# Altium schematic sheet MCU-STM32F767.SchDoc
size A4
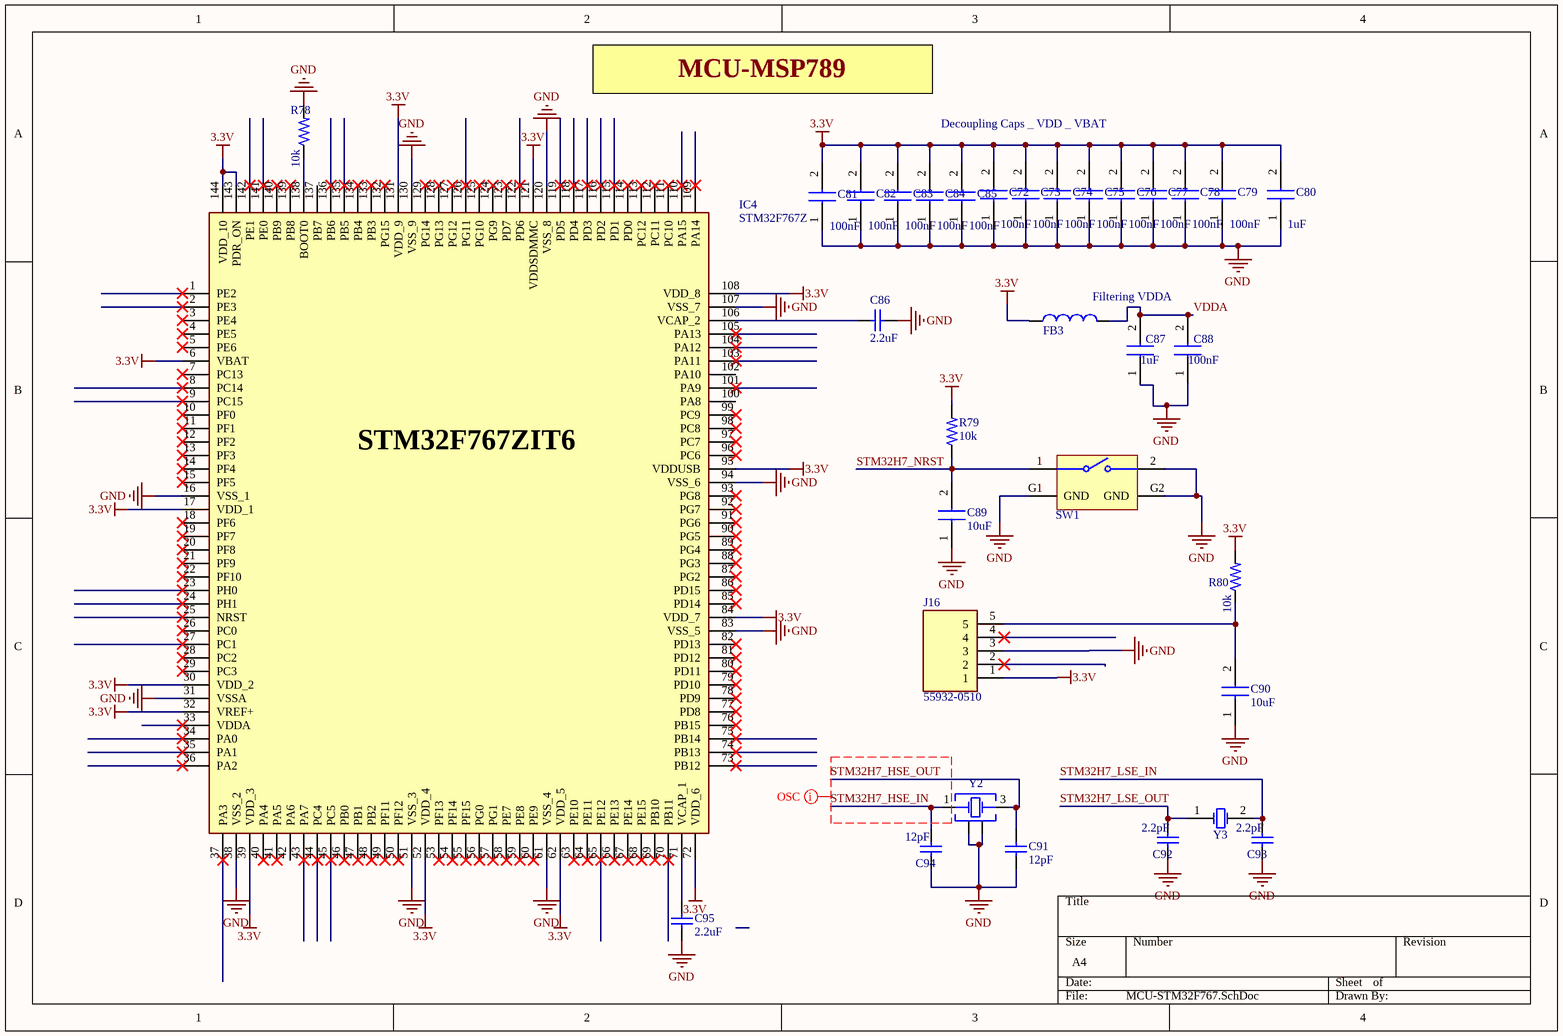
[diagram p0: MCU-STM32F767.SchDoc]

## Parts
C72  100nF  [CAPC1005X55N]
C73  100nF  [CAPC1005X55N]
C74  100nF  [CAPC1005X55N]
C75  100nF  [CAPC1005X55N]
C76  100nF  [CAPC1005X55N]
C77  100nF  [CAPC1005X55N]
C78  100nF  [CAPC1005X55N]
C79  100nF  [CAPC1005X55N]
C80  1uF  [CAPC1005X55N]
C81  100nF  [CAPC1005X55N]
C82  100nF  [CAPC1005X55N]
C83  100nF  [CAPC1005X55N]
C84  100nF  [CAPC1005X55N]
C85  100nF  [CAPC1005X55N]
C86  2.2uF  [WCAP-CSST_0603_L1.6W0.8H0.8_Reflow]
C87  1uF  [CAPC1005X55N]
C88  100nF  [CAPC1005X55N]
C89  10uF  [CAPC1005X55N]
C90  10uF  [CAPC1005X55N]
C91  12pF  [WCAP-CSST_0603_L1.6W0.8H0.8_Reflow]
C92  2.2pF  [WCAP-CSST_0603_L1.6W0.8H0.8_Reflow]
C93  2.2pF  [WCAP-CSST_0603_L1.6W0.8H0.8_Reflow]
C94  12pF  [WCAP-CSST_0603_L1.6W0.8H0.8_Reflow]
C95  2.2uF  [WCAP-CSST_0603_L1.6W0.8H0.8_Reflow]
FB3  10Ohm  [WE-CBA_0603_L1.6W0.8H0.8_HF/HS/WB]  (value not drawn)
IC4  STM32F767Z  [QFP50P2200X2200X160-144N]
J16  55932-0510  [559320510]
R78  10k  [RESC2012X65N]
R79  10k  [RESC2012X65N]
R80  10k  [RESC2012X65N]
SW1  431256058716  [4312560587x6]  (value not drawn)
Y2  25MHz  [WE-XTAL_CFPX-180]  (value not drawn)
Y3  32.768kHz  [WE-XTAL_IQXC-25]  (value not drawn)

## Nets
3.3V: C72.2 C73.2 C74.2 C75.2 C76.2 C77.2 C78.2 C79.2 C80.2 C81.2 C82.2 C83.2 C84.2 C85.2 FB3.1 IC4.6(VBAT) IC4.17(VDD_1) IC4.30(VDD_2) IC4.32(VREF+) IC4.39(VDD_3) IC4.52(VDD_4) IC4.62(VDD_5) IC4.72(VDD_6) IC4.84(VDD_7) IC4.95(VDDUSB) IC4.108(VDD_8) IC4.121(VDDSDMMC) IC4.131(VDD_9) IC4.143(PDR_ON) IC4.144(VDD_10) J16.1 R79.2 R80.2
GND: C72.1 C73.1 C74.1 C75.1 C76.1 C77.1 C78.1 C79.1 C80.1 C81.1 C82.1 C83.1 C84.1 C85.1 C86.2 C87.1 C88.1 C89.1 C90.1 C91.2 C92.2 C93.2 C94.2 C95.1 IC4.16(VSS_1) IC4.31(VSSA) IC4.38(VSS_2) IC4.51(VSS_3) IC4.61(VSS_4) IC4.83(VSS_5) IC4.94(VSS_6) IC4.107(VSS_7) IC4.120(VSS_8) IC4.130(VSS_9) J16.3 R78.2 SW1.2 SW1.G1(GND) SW1.G2(GND) Y2.2(GND&Lid) Y2.4(GND&Lid)
STM32H7_HSE_IN: C94.1 Y2.1(Crystal)
STM32H7_HSE_OUT: C91.1 Y2.3(Crystal)
STM32H7_LSE_IN: C93.1 Y3.2(OSC2)
STM32H7_LSE_OUT: C92.1 Y3.1(OSC1)
STM32H7_NRST: C89.2 R79.1 SW1.1
VDDA: C87.2 C88.2 FB3.2
NetC86_1: C86.1 IC4.106(VCAP_2)
NetC90_2: C90.2 J16.5 R80.1
NetC95_2: C95.2 IC4.71(VCAP_1)
NetIC4_138: IC4.138(BOOT0) R78.1

Not connected (* = marked no-connect by the designer): IC4 1(PE2)* 2(PE3)* 3(PE4)* 4(PE5)* 5(PE6)* 7(PC13)* 8(PC14)* 9(PC15)* 10(PF0)* 11(PF1)* 12(PF2)* 13(PF3)* 14(PF4)* 15(PF5)* 18(PF6)* 19(PF7)* 20(PF8)* 21(PF9)* 22(PF10)* 23(PH0)* 24(PH1)* 25(NRST)* 26(PC0)* 27(PC1)* 28(PC2)* 29(PC3)* 33(VDDA)* 34(PA0)* 35(PA1)* 36(PA2)* 37(PA3)* 40(PA4)* 41(PA5)* 42(PA6) 43(PA7)* 44(PC4)* 45(PC5)* 46(PB0)* 47(PB1)* 48(PB2)* 49(PF11)* 50(PF12)* 53(PF13)* 54(PF14)* 55(PF15)* 56(PG0)* 57(PG1)* 58(PE7)* 59(PE8)* 60(PE9)* 63(PE10)* 64(PE11)* 65(PE12)* 66(PE13)* 67(PE14)* 68(PE15)* 69(PB10)* 70(PB11)* 73(PB12)* 74(PB13)* 75(PB14)* 76(PB15)* 77(PD8)* 78(PD9)* 79(PD10)* 80(PD11)* 81(PD12)* 82(PD13)* 85(PD14)* 86(PD15)* 87(PG2)* 88(PG3)* 89(PG4)* 90(PG5)* 91(PG6)* 92(PG7)* 93(PG8)* 96(PC6)* 97(PC7)* 98(PC8)* 99(PC9)* 100(PA8) 101(PA9)* 102(PA10) 103(PA11)* 104(PA12)* 105(PA13)* 109(PA14)* 110(PA15)* 111(PC10)* 112(PC11)* 113(PC12)* 114(PD0)* 115(PD1)* 116(PD2)* 117(PD3)* 118(PD4)* 119(PD5)* 122(PD6)* 123(PD7)* 124(PG9)* 125(PG10)* 126(PG11)* 127(PG12)* 128(PG13)* 129(PG14)* 132(PG15)* 133(PB3)* 134(PB4)* 135(PB5)* 136(PB6)* 137(PB7) 139(PB8)* 140(PB9)* 141(PE0)* 142(PE1)*; J16 2* 4*

## Layout directives
net class OSC: (no net found under the mark)

## Notes on the sheet
- MCU-MSP789
- Decoupling Caps _ VDD _ VBAT
- (near FB3) Filtering VDDA
- (in symbol STM32F767Z) STM32F767ZIT6

## Library data of the parts
C72-C85 = 6V 100nF X7R ±10% 0402 Multilayer: Capacitor; Manufacturer_Name: SAMSUNG; Manufacturer_Part_Number: CL05B104KO5NNNC; Datasheet Link: https://datasheet.datasheetarchive.com/originals/distributors/Datasheets-DGA10/2408147.pdf; Height: 0.55mm; Mouser Part Number: 187-CL05B104KO5NNNC; Mouser Price/Stock: https://www.mouser.co.uk/ProductDetail/Samsung-Electro-Mechanics/CL05B104KO5NNNC?qs=hqM3L16%252BxlfT2SKOuAUq6Q%3D%3D; Arrow Part Number: CL05B104KO5NNNC; Arrow Price/Stock: https://www.arrow.com/en/products/cl05b104ko5nnnc/samsung-electro-mechanics?region=europe
C86 C91-C95 = 0.1uF capacitor: WCAP-CSST Multilayer Ceramic Chip Capacitor, Soft Termination, size 0603, X7R Class II, 220pF, 50VDC; Manufacturer Part Number: 885382206001; Manufacturer: Wurth Elektronik; Case/Size Code: 0603; Capacitance Tolerance: +/-10%; Dissipation Factor: 2.5%; Insulation Resistance: 10GΩ; Rated Voltage (DC): 50V; Technical Reference: X7R0603221K050DFCT1S000; Category: Multilayer Ceramic Chip Capacitors; Match Code: WCAP-CSST; ComponentLink1Description: Website Link; ComponentLink1URL: https://www.we-online.com/redexpert/article/885382206001?ad; ComponentLink2Description: Datasheet Link; ComponentLink2URL: https://www.we-online.com/redexpert/spec/885382206001?ad; Mount: Surface Mount; Operating Temperature Max: 125°C; Operating Temperature Min: -55°C; Packaging: Tape and Reel; Length: 1.6mm; Width: 0.8mm; Height: 0.8mm; Capacitance: 220pF; Ceramic Type: X7R Class II
C87 C88 = CL05B104KO5NNNC: Capacitor; Manufacturer_Name: SAMSUNG; Datasheet Link: https://datasheet.datasheetarchive.com/originals/distributors/Datasheets-DGA10/2408147.pdf; Height: 0.55mm; Manufacturer_Part_Number: CL05B104KO5NNNC; Mouser Part Number: 187-CL05B104KO5NNNC; Mouser Price/Stock: https://www.mouser.co.uk/ProductDetail/Samsung-Electro-Mechanics/CL05B104KO5NNNC?qs=hqM3L16%252BxlfT2SKOuAUq6Q%3D%3D; Arrow Part Number: CL05B104KO5NNNC; Arrow Price/Stock: https://www.arrow.com/en/products/cl05b104ko5nnnc/samsung-electro-mechanics?region=europe
C89 C90 = 0.1uF_603_Capacitor_NL: Capacitor; Manufacturer_Name: YAGEO; Manufacturer_Part_Number: CC0603KRX7R9BB104; Datasheet Link: https://componentsearchengine.com/Datasheets/2/CC0603KRX7R9BB104.pdf; Height: 0.9mm; Mouser Part Number: 603-CC603KRX7R9BB104; Mouser Price/Stock: https://www.mouser.co.uk/ProductDetail/YAGEO/CC0603KRX7R9BB104?qs=vTakOoo5QyLvVCYM2ge8LQ%3D%3D; Arrow Part Number: CC0603KRX7R9BB104; Arrow Price/Stock: https://www.arrow.com/en/products/cc0603krx7r9bb104/yageo?region=europe
FB3 = Ferrite-Beads_0603: WE-CBA SMT EMI Suppression Ferrite Bead, size 0201, 10Ohm, 0.65A; Manufacturer Part Number: 782219100; Manufacturer: Wurth Elektronik; Case/Size Code: 0201; DC Resistance Max: 0.055Ohm; Impedance Max: 12.6Ohm; Impedance Max Test Condition: 954MHz; Type: Wide Band; Category: Ferrites for PCB Assembly; Match Code: WE-CBA; ComponentLink1Description: Website Link; ComponentLink1URL: https://www.we-online.com/redexpert/article/782219100?ad; ComponentLink2Description: Datasheet Link; ComponentLink2URL: https://www.we-online.com/redexpert/spec/782219100?ad; Mount: Surface Mount; Operating Temperature Max: 125°C; Operating Temperature Min: -55°C; Packaging: Tape and Reel; Length: 0.6mm; Width: 0.3mm; Height: 0.3mm; Automotive: Yes; Impedance @100MHz: 10Ohm; Rated Current: 0.65A
IC4 = STM32F767Z: Integrated Circuit; Manufacturer_Name: STMicroelectronics; Manufacturer_Part_Number: STM32F767ZGT6; Datasheet Link: http://www.st.com/content/ccc/resource/technical/document/datasheet/group3/c5/37/9c/1d/a6/09/4e/1a/DM00273119/files/DM00273119.pdf/jcr:content/translations/en.DM00273119.pdf; Height: 1.6mm; Mouser Part Number: 511-STM32F767ZGT6; Mouser Price/Stock: https://www.mouser.co.uk/ProductDetail/STMicroelectronics/STM32F767ZGT6?qs=qzCNEk%252BRr%252BZ4AVbZI2VU4A%3D%3D; Arrow Part Number: STM32F767ZGT6; Arrow Price/Stock: https://www.arrow.com/en/products/stm32f767zgt6/stmicroelectronics?region=nac
J16 = SWD_DEBEG: Connector; Manufacturer_Name: Molex; Datasheet Link: https://componentsearchengine.com/Datasheets/2/55932-0510.pdf; Height: 9.95mm; Manufacturer_Part_Number: 55932-0510; Mouser Part Number: 538-55932-0510; Mouser Price/Stock: https://www.mouser.co.uk/ProductDetail/Molex/55932-0510?qs=iFujUUZFeMLhWbots6k70A%3D%3D
R78-R80 = resisitor: Fixed Resistors; MP: CRG0805F33R; MF: TE Connectivity; Price: None; Package: 0805; Value: *; Purchase-URL: https://pricing.snapeda.com/search/part/CRG0805F33R/?ref=eda; Check_prices: https://www.snapeda.com/parts/CRG0805F33R/TE+Connectivity+Passive+Product/view-part/?ref=eda; Availability: In Stock; EU_RoHS_Compliance: Compliant with Exemptions; SnapEDA_Link: https://www.snapeda.com/parts/CRG0805F33R/TE+Connectivity+Passive+Product/view-part/?ref=snap
SW1 = reset_button: WS-TATU THT Tact Switch 6x6mm Right Angled Type with ground terminal, SPST-NO, 12VDC, 50mA, 160g; Manufacturer: Wurth Elektronik; Washable: No; ComponentLink1Description: Website Link; ComponentLink1URL: https://www.we-online.com/redexpert/article/431256058716?ad; ComponentLink2Description: Datasheet Link; ComponentLink2URL: https://www.we-online.com/redexpert/spec/431256058716?ad; Manufacturer Part Number: 431256058716; Category: Tact Switches; Match Code: WS-TATU; Mount: Through Hole; Operating Temperature Max: 85°C; Operating Temperature Min: -40°C; Packaging: Bulk; Length: 6mm; Width: 6mm; Height: 5.85mm; Circuit: SPST-NO; Contact Material: Stainless Steel; Contact Plating: Silver; Operation Force: 160g; Rated Current: 50mA; Rated Voltage: 12VDC; Terminal Material: Copper Alloy; Terminal Plating: Silver
Y2 = Crystals: WE-XTAL Quartz Crystal, SMT, CFPX-180, 25MHz, +/-10ppm; Manufacturer Part Number: 830108174209; Manufacturer: Wurth Elektronik; Frequency Stability: +/-15ppm; Load Capacitance: 10pF; ComponentLink1Description: Website Link; ComponentLink1URL: https://www.we-online.com/redexpert/article/830108174209?ad; ComponentLink2Description: Datasheet Link; ComponentLink2URL: https://www.we-online.com/redexpert/spec/830108174209?ad; Category: Crystals; Match Code: WE-XTAL; Mount: Surface Mount; Operating Temperature Max: 85°C; Operating Temperature Min: -40°C; Packaging: Tape and Reel; Case/Size Code: CFPX-180; Length: 3.4mm; Width: 2.7mm; Height: 0.8mm; Frequency: 25MHz; Frequency Tolerance: +/-10ppm
Y3 = CRYSTAL 32.768kH: WE-XTAL Watch Crystal, SMT, IQXC-25, 32.768kHz, +/-10ppm; Manufacturer Part Number: 830062558; Manufacturer: Wurth Elektronik; Load Capacitance: 9pF; ComponentLink1Description: Website Link; ComponentLink1URL: https://www.we-online.com/redexpert/article/830062558?ad; ComponentLink2Description: Datasheet Link; ComponentLink2URL: https://www.we-online.com/redexpert/spec/830062558?ad; Category: Crystals; Match Code: WE-XTAL; Mount: Surface Mount; Operating Temperature Max: 85°C; Operating Temperature Min: -40°C; Packaging: Tape and Reel; Case/Size Code: IQXC-25; Length: 2mm; Width: 1.2mm; Height: 0.6mm; Frequency: 32.768kHz; Frequency Tolerance: +/-10ppm